# Altium project SoM.PrjPcb (part 3 of 4)

## Sheet [16] SPI_TYPEC_PWR.SchDoc: SPI, POWER and type C connector
size B; DocumentNumber: I; Revision: 01; SheetNumber: 16; SheetTotal: 19
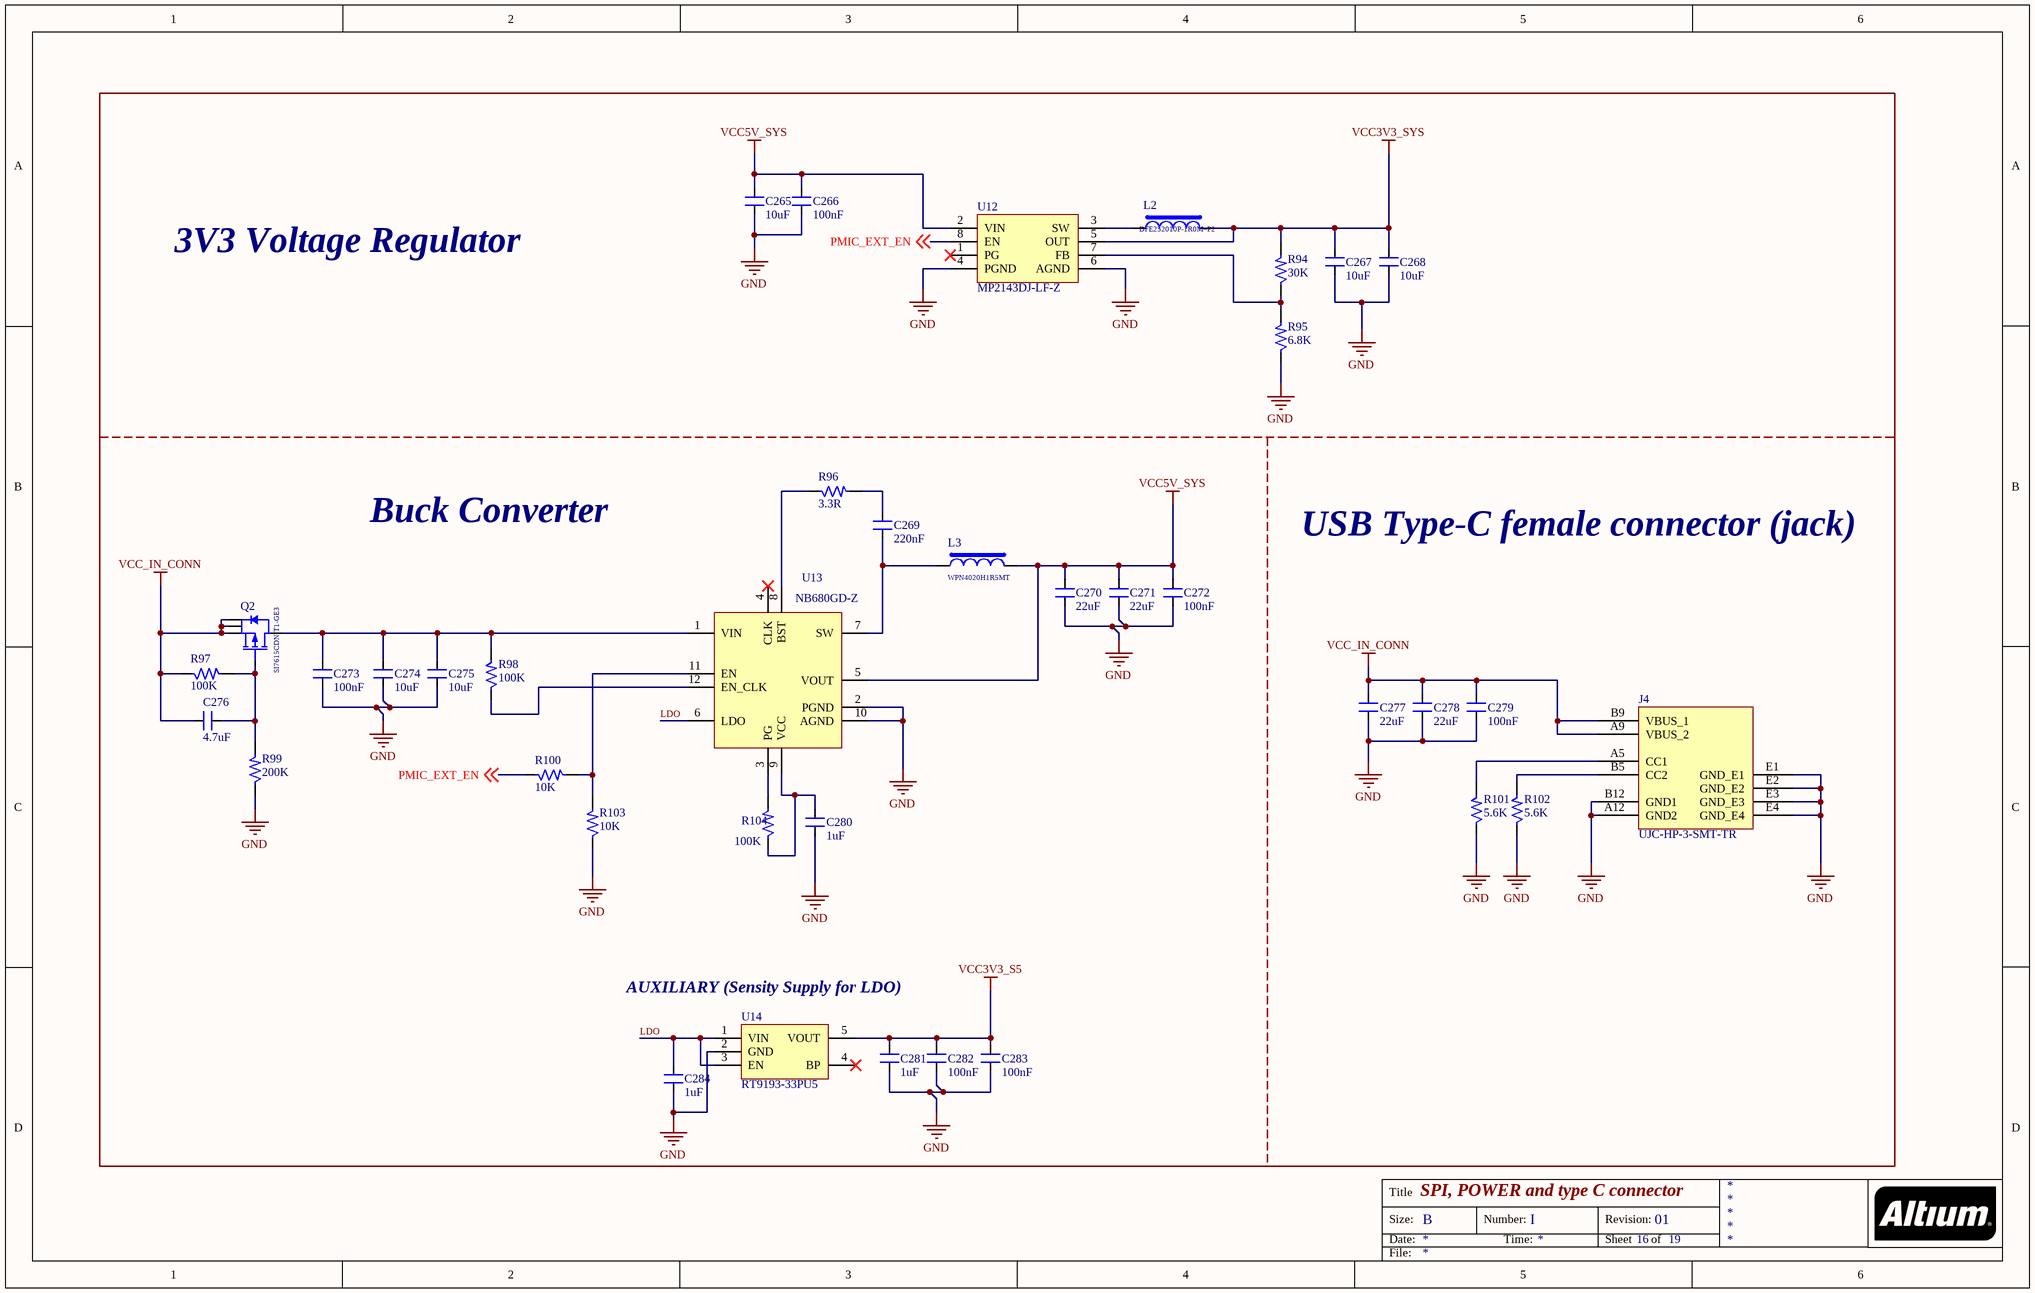
[diagram p15: [16] SPI_TYPEC_PWR.SchDoc]

### Parts
C265  10uF  [CAP_0402]
C266  100nF  [CAP_0402]
C267  10uF  [CAP_0402]
C268  10uF  [CAP_0402]
C269  220nF  [CAP_0402]
C270  22uF  [CAP_0402]
C271  22uF  [CAP_0402]
C272  100nF  [CAP_0402]
C273  100nF  [CAP_0402]
C274  10uF  [CAP_0402]
C275  10uF  [CAP_0402]
C276  4.7uF  [CAP_0402]
C277  22uF  [CAP_0402]
C278  22uF  [CAP_0402]
C279  100nF  [CAP_0201]
C280  1uF  [CAP_0402]
C281  1uF  [CAP_0402]
C282  100nF  [CAP_0402]
C283  100nF  [CAP_0402]
C284  1uF  [CAP_0402]
J4  UJC-HP-3-SMT-TR  [CON6_48.4_UJC-HP-3-SMT-TR]
L2  DFE252010P-1R0M=P2  [IND_1008]
L3  WPN4020H1R5MT  [IND_1616]
Q2  SI7615CDN-T1-GE3  [PowerPAK_1212-8_SMD]
R94  30K  [RES_0402]
R95  6.8K  [RES_0402]
R96  3.3R  [RES_0402]
R97  100K  [RES_0402]
R98  100K  [RES_0402]
R99  200K  [RES_0402]
R100  10K  [RES_0402]
R101  5.6K  [RES_0201]
R102  5.6K  [RES_0201]
R103  10K  [RES_0402]
R104  100K  [RES_0402]
U12  MP2143DJ-LF-Z  [SOT23-8]
U13  NB680GD-Z  [QFN-12_19_118X118_SMD]
U14  RT9193-33PU5  [SC70-5]

### Nets
GND: C265.1 C266.1 C267.1 C268.1 C270.1 C271.1 C272.1 C273.1 C274.1 C275.1 C277.1 C278.1 C279.1 C280.1 C281.1 C282.1 C283.1 C284.1 J4.A12(GND2) J4.B12(GND1) J4.E1(GND_E1) J4.E2(GND_E2) J4.E3(GND_E3) J4.E4(GND_E4) R95.1 R99.1 R101.1 R102.1 R103.1 U12.4(PGND) U12.6(AGND) U13.2(PGND) U13.10(AGND) U14.2(GND)
VCC3V3_S5: C281.2 C282.2 C283.2 U14.5(VOUT)
VCC3V3_SYS: C267.2 C268.2 L2.2 R94.2 U12.5(OUT)  [project net VCC7]
VCC5V_SYS: C265.2 C266.2 C270.2 C271.2 C272.2 L3.2 U12.2(VIN) U13.5(VOUT)
VCC_IN_CONN: C276.1 C277.2 C278.2 C279.2 J4.A9(VBUS_2) J4.B9(VBUS_1) Q2.1(S) Q2.2(S) Q2.3(S) R97.1
LDO: C284.2 U13.6(LDO) U14.1(VIN) U14.3(EN)
PMIC_EXT_EN: R100.1 U12.8(EN) ; off-sheet PMIC_EXT_EN
NetC269_1: C269.1 L3.1 U13.7(SW)
NetC269_2: C269.2 R96.2
NetC273_2: C273.2 C274.2 C275.2 Q2.5(D) R98.2 U13.1(VIN)
NetC276_2: C276.2 Q2.4(G) R97.2 R99.2
NetC280_2: C280.2 R104.1 U13.9(VCC)
NetJ4_A5: J4.A5(CC1) R101.2
NetJ4_B5: J4.B5(CC2) R102.2
NetL2_1: L2.1 U12.3(SW)
NetR94_1: R94.1 R95.2 U12.7(FB)
NetR96_1: R96.1 U13.8(BST)
NetR98_1: R98.1 U13.12(EN_CLK)
NetR100_2: R100.2 R103.2 U13.11(EN)
NetR104_2: R104.2 U13.3(PG)

Not connected (* = marked no-connect by the designer): U12 1(PG)*; U13 4(CLK)*; U14 4(BP)*

### Notes on the sheet
- 3V3 Voltage Regulator
- Buck Converter
- USB Type-C female connector (jack)
- AUXILIARY (Sensity Supply for LDO)
- Title
- Size:
- Date:
- B
- Number:
- Time:
- Revision:
- Sheet
- of
- File:

### Library data of the parts
C265 C267 C268 C274 C275 = CAP_10uF-10V-20%-0402: as C243 on sheet [13] TYPEC0_PROG; Case/Package: 0402; Supplier-1: Digikey
C266 = CAP_100nF-10V-10%-0402: 0.1µF ±10% 10V Ceramic Capacitor X7R 0402 (1005 Metric) /; Manufacturer: Yageo; Manufacturer Part Number: CC0402KRX7R6BB104; Case/Package: 0402; Supplier-1: Digikey
C269 = CAP_220nF-10V-10%-0402: 0.22µF ±10% 10V Ceramic Capacitor X7R 0402 (1005 Metric) /; Manufacturer: Samsung Electro-Mechanics; Manufacturer Part Number: CL05B224KP5NNNC; Case/Package: 0402; Supplier-1: Digikey
C270 C271 C277 C278 = CAP_22uF-6.3V-20%-0402: 22µF ±20% 6.3V Ceramic Capacitor X5R 0402 (1005 Metric) /; Manufacturer: Murata Electronics; Manufacturer Part Number: CL05A226MQ5N6J8; Case/Package: 0402; Supplier-1: Digikey
C272 C273 C282 C283 = CAP_100nF-25V-10%-0402: as C231 on sheet [13] TYPEC0_PROG; Case/Package: 0402; Supplier-1: Digikey
C276 = CAP_4.7uF-10V-10%-0402: 4.7µF ±10% 10V Ceramic Capacitor X5R 0402 (1005 Metric) /; Manufacturer: Samsung Electro-Mechanics; Manufacturer Part Number: CL05A475KP5NRNC; Case/Package: 0402; Supplier-1: Digikey
C279 = CAP_100nF-25V-10%-0201: as C187-C190 on sheet [4] RK3399_EMMC_ADC_PCIE; Case/Package: 0201; Supplier-1: Digikey
C280 = CAP_1uF-16V-10%-0402: as C252 on sheet [14] Ethernet; Case/Package: 0402; Supplier-1: Digikey
C281 C284 = CAP_1uF-10V-10%-0402: as C232-C234 on sheet [13] TYPEC0_PROG; Case/Package: 0402; Supplier-1: Digikey
J4 = CON-TYPEC_6X1-100-RA-TH: USB Connectors USB jack, C type, power only, 6 pin, horizonal, gold flash plating, surface mount, T&R; Manufacturer: CUI Devices; Manufacturer Part Number: UJC-HP-3-SMT-TR; Case/Package: TH; Supplier-1: Mouser
L2 = IND_1uH-3.8A-20%-1008: 1µH Shielded Wirewound Inductor 3.8A 54mOhm Max 1008 (2520 Metric) /; Manufacturer: Murata Electronics; Manufacturer Part Number: DFE252010P-1R0M=P2; Case/Package: 1008; Supplier-1: Digikey
L3 = IND_1.5uH-6A-20%-SMD: Wire Wound SMD Power Inductors – WPN Series / Operating Temp. : -40℃~+125℃ (Including self-heating) /; Manufacturer: Sunlord; Mnaufcaturer Part Number: WPN4020H1R5MT; Case/Package: SMD; Supplier-1: NA
Q2 = MOSFET-P_20V-35A-1212-8: P-Channel 20V 35A (Tc) 33W (Tc) Surface Mount PowerPAK® 1212-8 /; Manufacturer: Vishay Siliconix; Manufacturer Part Number: SI7615CDN-T1-GE3; Case/Package: PowerPAK® 1212-8; Supplier-1: Digikey
R94 = RES_30K-0.1W-1%-0402: 30 kOhms ±1% 0.1W, 1/10W Chip Resistor 0402 (1005 Metric) Automotive AEC-Q200, Moisture Resistant Thick Film /; Manufacturer: KOA Speer Electronics, Inc.; Manufacturer Part Number: RK73H1ETTP3002F; Case/Package: 0402; Supplier-1: Digikey
R95 = RES_6.8K-0.1W-1%-0402: 6.8 kOhms ±1% 0.1W, 1/10W Chip Resistor 0402 (1005 Metric) Anti-Sulfur Thin Film /; Manufacturer: Vishay Beyschlag/Draloric/BC Components; Manufacturer Part Number: MCS04020C6801FE000; Supplier-1: Digikey; Case/Package: 0402
R96 = RES_3.3R-0.1W-1%-0402: 3.3 Ohms ±1% 0.1W, 1/10W Chip Resistor 0402 (1005 Metric) Anti-Sulfur, Automotive AEC-Q200 Thick Film /; Manufacturer: Panasonic Electronic Components; Manufacturer Part Number: ERJ-U02F3R30X; Case/Package: 0402; Supplier-1: Digikey
R97 R98 R104 = RES_100K-0.1W-1%-0402: 100 kOhms ±1% 0.1W, 1/10W Chip Resistor 0402 (1005 Metric) Anti-Sulfur Thin Film /; Manufacturer: Vishay Beyschlag/Draloric/BC Components; Manufacturer Part Number: MCS04020C1003FE000; Case/Package: 0402; Supplier-1: Digikey
R99 = RES_200K-0.1W-1%-0402: 200 kOhms ±1% 0.1W, 1/10W Chip Resistor 0402 (1005 Metric) Automotive AEC-Q200 Thick Film /; Manufacturer: Panasonic Electronic Components; Manufacturer Part number: ERJ-2RKF2003X; Case/Package: 0402; Supplier-1: Digikey
R100 R103 = RES_10K-0.1W-1%-0402: 10 kOhms ±1% 0.1W, 1/10W Chip Resistor 0402 (1005 Metric) Anti-Sulfur Thin Film /; Manufacturer: Vishay Beyschlag/Draloric/BC Components; Manufacturer Part Number: MCS04020C1002FE000; Case/Package: 0402; Supplier-1: Digikey
R101 R102 = RES_5.6K-0.05W-1%-0201: 5.6 kOhms ±1% 0.05W, 1/20W Chip Resistor 0201 (0603 Metric) Automotive AEC-Q200 Thick Film /; Manufacturer: Panasonic Electronic Components; Manufacturer Part Number: ERJ-1GNF5601C; Case/Package: 0201; Supplier-1: Digikey
U12 = REG_0.6~5V-5.5V-3A-TSOT-23-8: Switching Voltage Regulators 3A, 5.5V, 1.2MHz Sync Stp-Dwn Swtchr; Manufacturer: Monolithic Power Systems (MPS); Manufacturer Part Number: MP2143DJ-LF-Z; Case/Package: TSOT-23-8; Supplier-1: Mouser
U13 = REG_3.3V-26V-8A-QFN-12: Switching Voltage Regulators 26V Fixed 3.3 V-8A Sync Buck Converter; Manufacturer: Monolithic Power Systems (MPS); Manufacturer Part Number: NB680GD-Z; Case/Package: QFN-12; Supplier-1: Mouser
U14 = REG_3.3V-5.5V-300mA-SC-70-5: SC-70-5 Dropout Regulators(LDO) RoHS; Manufacturer: Richtek Tech; Manufacturer Part Number: RT9193-33PU5; Case/Package: SC-70-5; Supplier-1: LCSC

## Sheet [17] Voltage_Regulators.SchDoc: Voltage Regulators
size B; DocumentNumber: I; Revision: 01; SheetNumber: 17; SheetTotal: 19
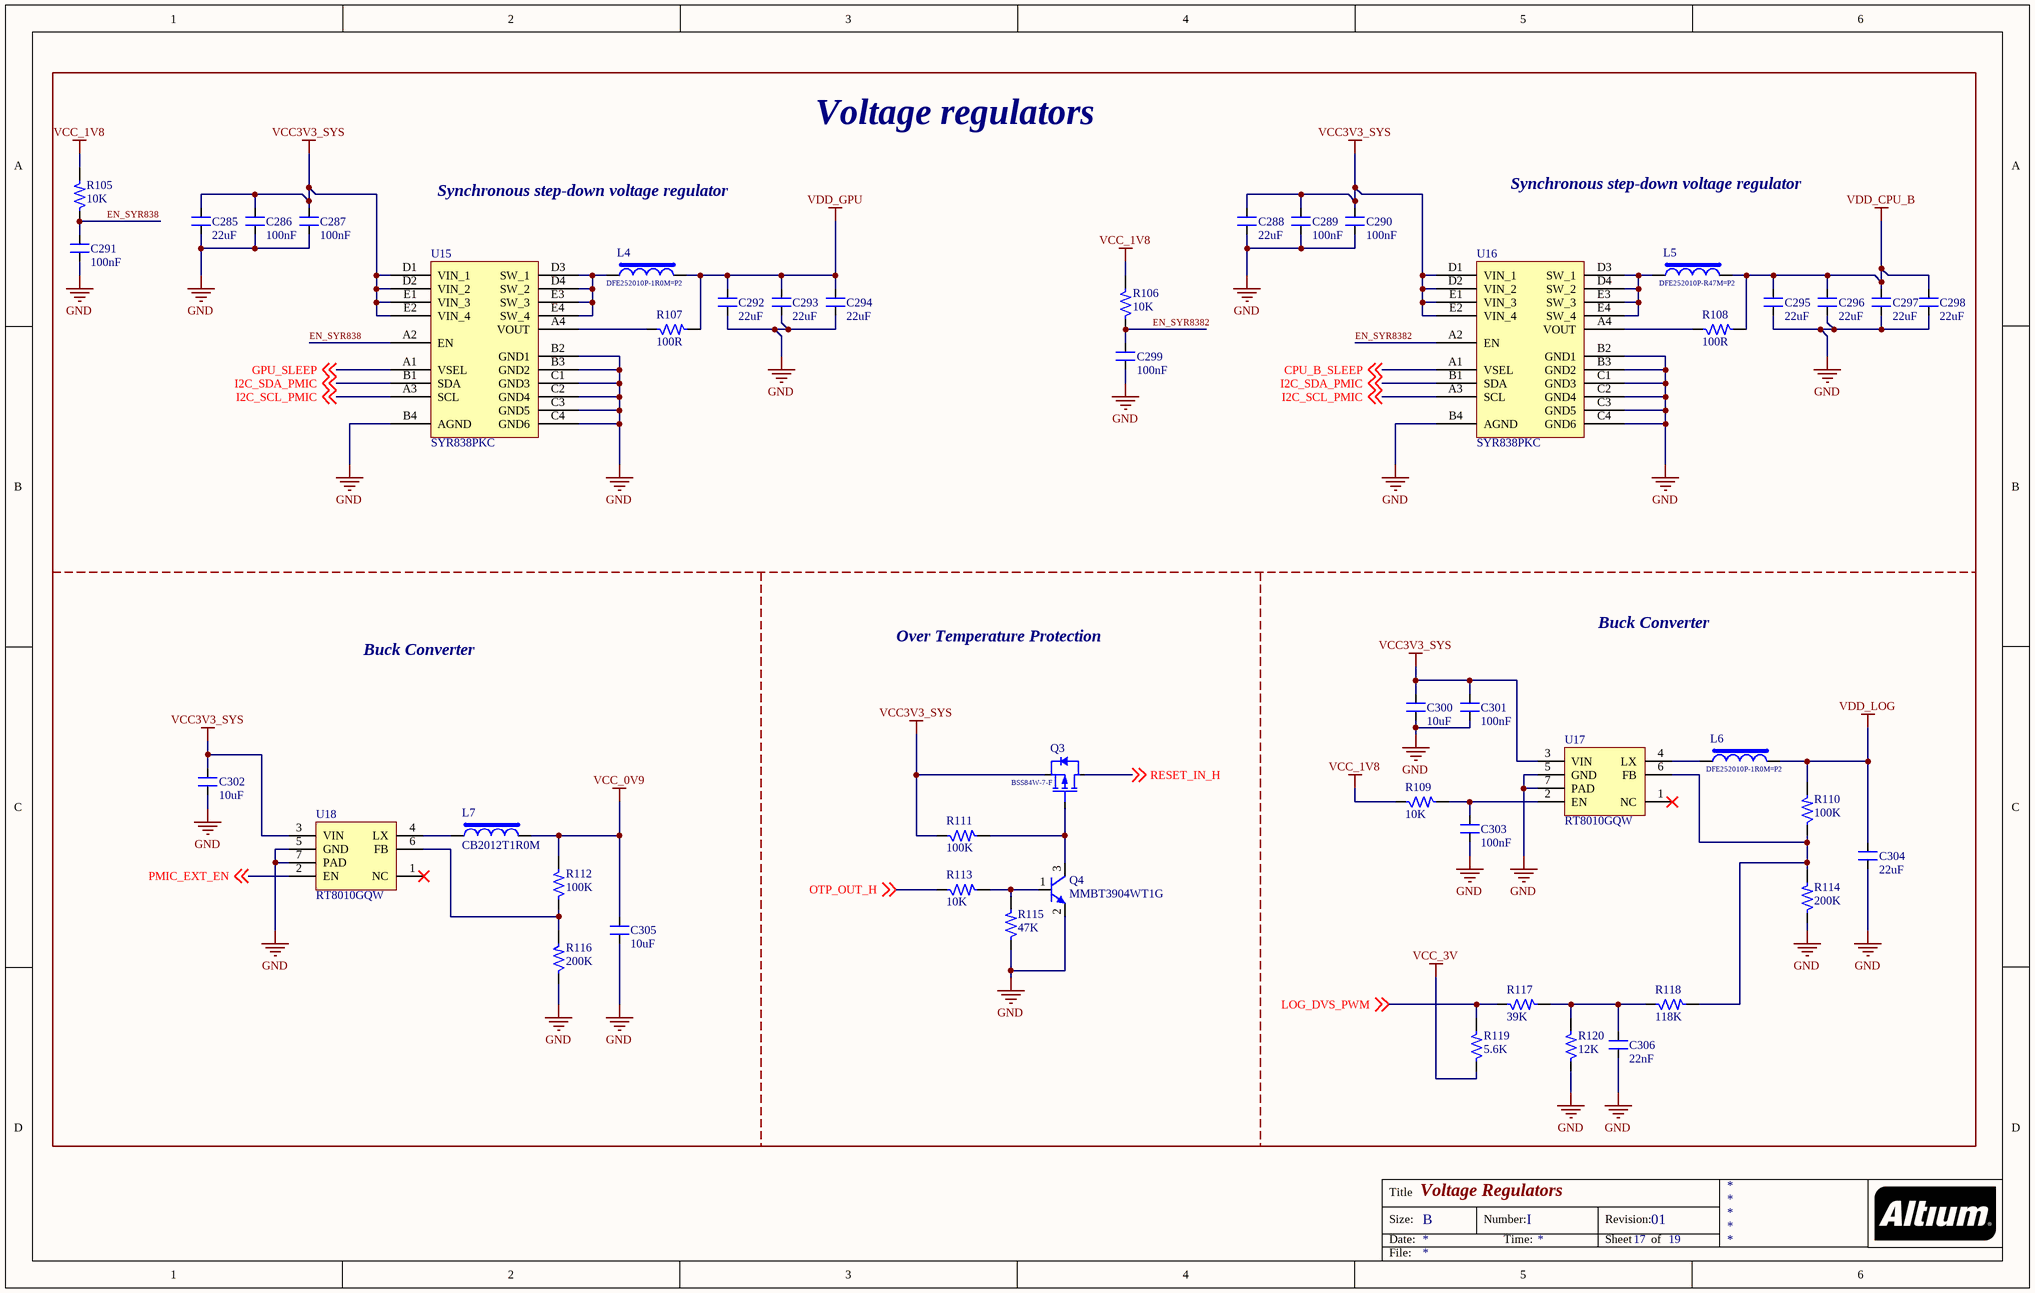
[diagram p16: [17] Voltage_Regulators.SchDoc]

### Parts
C285  22uF  [CAP_0402]
C286  100nF  [CAP_0402]
C287  100nF  [CAP_0402]
C288  22uF  [CAP_0402]
C289  100nF  [CAP_0402]
C290  100nF  [CAP_0402]
C291  100nF  [CAP_0402]
C292  22uF  [CAP_0402]
C293  22uF  [CAP_0402]
C294  22uF  [CAP_0402]
C295  22uF  [CAP_0402]
C296  22uF  [CAP_0402]
C297  22uF  [CAP_0402]
C298  22uF  [CAP_0402]
C299  100nF  [CAP_0402]
C300  10uF  [CAP_0402]
C301  100nF  [CAP_0402]
C302  10uF  [CAP_0402]
C303  100nF  [CAP_0402]
C304  22uF  [CAP_0402]
C305  10uF  [CAP_0402]
C306  22nF  [CAP_0402]
L4  DFE252010P-1R0M=P2  [IND_1008]
L5  DFE252010P-R47M=P2  [IND_1008]
L6  DFE252010P-1R0M=P2  [IND_1008]
L7  CB2012T1R0M  [IND_0805]
Q3  BSS84W-7-F  [SOT-323-3]
Q4  MMBT3904WT1G  [SOT-323-3]
R105  10K  [RES_0402]
R106  10K  [RES_0402]
R107  100R  [RES_0402]
R108  100R  [RES_0402]
R109  10K  [RES_0402]
R110  100K  [RES_0402]
R111  100K  [RES_0402]
R112  100K  [RES_0402]
R113  10K  [RES_0402]
R114  200K  [RES_0402]
R115  47K  [RES_0402]
R116  200K  [RES_0402]
R117  39K  [RES_0402]
R118  118K  [RES_0402]
R119  5.6K  [RES_0402]
R120  12K  [RES_0402]
U15  SYR838PKC  [CSP20_15.7_100x84_SMD]
U16  SYR838PKC  [CSP20_15.7_100x84_SMD]
U17  RT8010GQW  [WDFN-6_26_133X100_SMD]
U18  RT8010GQW  [WDFN-6_26_133X100_SMD]

### Nets
GND: C285.1 C286.1 C287.1 C288.1 C289.1 C290.1 C291.1 C292.1 C293.1 C294.1 C295.1 C296.1 C297.1 C298.1 C299.1 C300.1 C301.1 C302.1 C303.1 C304.1 C305.1 C306.1 Q4.2(E) R114.1 R115.1 R116.1 R120.1 U15.B2(GND1) U15.B3(GND2) U15.B4(AGND) U15.C1(GND3) U15.C2(GND4) U15.C3(GND5) U15.C4(GND6) U16.B2(GND1) U16.B3(GND2) U16.B4(AGND) U16.C1(GND3) U16.C2(GND4) U16.C3(GND5) U16.C4(GND6) U17.5(GND) U17.7(PAD) U18.5(GND) U18.7(PAD)
VCC3V3_SYS: C285.2 C286.2 C287.2 C288.2 C289.2 C290.2 C300.2 C301.2 C302.2 Q3.2(S) R111.1 U15.D1(VIN_1) U15.D2(VIN_2) U15.E1(VIN_3) U15.E2(VIN_4) U16.D1(VIN_1) U16.D2(VIN_2) U16.E1(VIN_3) U16.E2(VIN_4) U17.3(VIN) U18.3(VIN)  [project net VCC7]
VCC_0V9: C305.2 L7.2 R112.2  [project net EDP_AVDD_0V9]
VCC_1V8: R105.2 R106.2 R109.1  [project net EDP_AVDD_1V8]
VCC_3V: R119.1  [project net VLDO8]
VDD_CPU_B: C295.2 C296.2 C297.2 C298.2 L5.2 R108.2
VDD_GPU: C292.2 C293.2 C294.2 L4.2 R107.2
VDD_LOG: C304.2 L6.2 R110.2
CPU_B_SLEEP: U16.A1(VSEL) ; off-sheet CPU_B_SLEEP
EN_SYR838: C291.2 R105.1 U15.A2(EN)
EN_SYR8382: C299.2 R106.1 U16.A2(EN)
GPU_SLEEP: U15.A1(VSEL) ; off-sheet GPU_SLEEP
I2C_SCL_PMIC: U15.A3(SCL) U16.A3(SCL) ; off-sheet I2C_SCL_PMIC
I2C_SDA_PMIC: U15.B1(SDA) U16.B1(SDA) ; off-sheet I2C_SDA_PMIC
LOG_DVS_PWM: R117.1 R119.2 ; off-sheet LOG_DVS_PWM
OTP_OUT_H: R113.1 ; off-sheet OTP_OUT_H
PMIC_EXT_EN: U18.2(EN) ; off-sheet PMIC_EXT_EN
RESET_IN_H: Q3.3(D) ; off-sheet RESET_IN_H
NetC303_2: C303.2 R109.2 U17.2(EN)
NetC306_2: C306.2 R117.2 R118.1 R120.2
NetL4_1: L4.1 U15.D3(SW_1) U15.D4(SW_2) U15.E3(SW_3) U15.E4(SW_4)
NetL5_1: L5.1 U16.D3(SW_1) U16.D4(SW_2) U16.E3(SW_3) U16.E4(SW_4)
NetL6_1: L6.1 U17.4(LX)
NetL7_1: L7.1 U18.4(LX)
NetQ3_1: Q3.1(G) Q4.3(C) R111.2
NetQ4_1: Q4.1(B) R113.2 R115.2
NetR107_1: R107.1 U15.A4(VOUT)
NetR108_1: R108.1 U16.A4(VOUT)
NetR110_1: R110.1 R114.2 R118.2 U17.6(FB)
NetR112_1: R112.1 R116.2 U18.6(FB)

Not connected (* = marked no-connect by the designer): U17 1(NC)*; U18 1(NC)*

### Notes on the sheet
- Voltage regulators
- Synchronous step-down voltage regulator
- Over Temperature Protection
- Buck Converter
- Title
- Size:
- Date:
- B
- Number:
- Time:
- Revision:
- Sheet
- of
- File:

### Library data of the parts
C285 C288 C292-C298 C304 = CAP_22uF-6.3V-20%-0402: as C270 on sheet [16] SPI_TYPEC_PWR; Case/Package: 0402; Supplier-1: Digikey
C286 C287 C289-C291 C299 = CAP_100nF-25V-10%-0402: as C231 on sheet [13] TYPEC0_PROG; Case/Package: 0402; Supplier-1: Digikey
C300 C302 C305 = CAP_10uF-10V-20%-0402: as C243 on sheet [13] TYPEC0_PROG; Case/Package: 0402; Supplier-1: Digikey
C301 C303 = CAP_100nF-10V-10%-0402: as C266 on sheet [16] SPI_TYPEC_PWR; Case/Package: 0402; Supplier-1: Digikey
C306 = CAP_22nF-10V-10%-0402: 0.022µF ±10% 10V Ceramic Capacitor X7R 0402 (1005 Metric) /; Manufacturer: Samsung Electro-Mechanics; Manufacturer Part Number: CL05B223KP5NNNC; Case/Package: 0402; Supplier-1: Digikey
L4 L6 = IND_1uH-3.8A-20%-1008: as L2 on sheet [16] SPI_TYPEC_PWR; Manufacturer Part Number: DFE252010P-1R0M=P2; Case/Package: 1008; Supplier-1: Digikey
L5 = IND_470nH-5A-20%-1008: 470nH Shielded Wirewound Inductor 5A 35mOhm Max 1008 (2520 Metric); Manufacturer: Murata Electronics; Manufacturer Part Number: DFE252010P-R47M=P2; Case/Package: 1008; Supplier-1: Digikey
L7 = IND_1uF-0.5A-20%-0805: 1uH ±20% 500mA 150mΩ 0805 Inductors (SMD) RoHS /; Manufacturer: Taiyo Yuden; Manufacturer Part Number: CB2012T1R0M; Case/Package: 0805; Supplier-1: LCSC
Q3 = MOSFET-P_50V-130mA-SOT-323: P-Channel 50V 130mA (Ta) 200mW (Ta) Surface Mount SOT-323; Manufacturer: Diodes Incorporated; Manufacturer Part Number: BSS84W-7-F; Case/Package: SOT-323; Supplier-1: Digikey
Q4 = TRAN-NPN_40V-200mA-SOT323: Bipolar (BJT) Transistor NPN 40V 200mA 300MHz 150mW Surface Mount SC-70-3 (SOT323); Manufacturer: ON Semiconductor; Manufacturer Part Number: MMBT3904WT1G; Case/Package: SOT323; Supplier-1: Digikey
R105 R106 R109 R113 = RES_10K-0.1W-1%-0402: as R100 on sheet [16] SPI_TYPEC_PWR; Case/Package: 0402; Supplier-1: Digikey
R107 R108 = RES_100R-0.1W-1%-0402: 100 Ohms ±1% 0.1W, 1/10W Chip Resistor 0402 (1005 Metric) Automotive AEC-Q200, Moisture Resistant Thick Film /; Manufacturer: KOA Speer Electronics, Inc.; Manufacturer Part Number: RK73H1ETTP1000F; Case/Package: 0402; Supplier-1: Digikey
R110-R112 = RES_100K-0.1W-1%-0402: as R97 on sheet [16] SPI_TYPEC_PWR; Case/Package: 0402; Supplier-1: Digikey
R114 R116 = RES_200K-0.1W-1%-0402: as R99 on sheet [16] SPI_TYPEC_PWR; Case/Package: 0402; Supplier-1: Digikey
R115 = RES_47K-0.1W-1%-0402: 47 kOhms ±1% 0.1W, 1/10W Chip Resistor 0402 (1005 Metric) Automotive AEC-Q200 Thick Film /; Manufacturer: Panasonic Electronic Components; Manufacturer Part Number: ERJ-2RKF4702X; Case/Package: 0402; Supplier-1: Digikey
R117 = RES_39K-0.1W-1%-0402: 39 kOhms ±1% 0.1W, 1/10W Chip Resistor 0402 (1005 Metric) Automotive AEC-Q200, Moisture Resistant Thick Film /; Manufacturer: KOA Speer Electronics, Inc.; Manufacturer Part Number: RK73H1ETTP3902F; Case/Package: 0402; Supplier-1: Digikey
R118 = RES_118K-0.1W-1%-0402: 118 kOhms ±1% 0.1W, 1/10W Chip Resistor 0402 (1005 Metric) Automotive AEC-Q200, Moisture Resistant Thick Film /; Manufacturer: KOA Speer Electronics, Inc.; Manuafcturer Part Number: RK73H1ETTP1183F; Case/Package: 0402; Supplier-1: Digikey
R119 = RES_5.6K-0.1W-1%-0402: 5.6 kOhms ±1% 0.1W, 1/10W Chip Resistor 0402 (1005 Metric) Automotive AEC-Q200, Moisture Resistant Thick Film /; Manufacturer: KOA Speer Electronics, Inc.; Manufacturer Part Number: RK73H1ETTP5601F; Case/Package: 0402; Supplier-1: Digikey
R120 = RES_12K-0.1W-1%-0402: 12 kOhms ±1% 0.1W, 1/10W Chip Resistor 0402 (1005 Metric) Anti-Sulfur Thin Film /; Manufacturer: Vishay Beyschlag/Draloric/BC Components; Manufacturer Part Number: MCS04020C1202FE000; Case/Package: 0402; Supplier-1: Digikey
U15 U16 = IC_SYR838PKC: Step-Down Positive Programmable 1 6A 2.4MHz CSP1.56*1.96-20 DC-DC Converters RoHS; Manufacturer: Silergy Corp; Manufacturer Part Number: SYR838PKC; Case/Package: CSP1.56*1.96-20; Supplier-1: LCSC
U17 U18 = REG-ADJ_5.5V-5.5V-1A-6-WDFN: Buck Switching Regulator IC Positive Adjustable 0.6V 1 Output 1A 6-WDFN Exposed Pad; Manufacturer: Richtek USA Inc.; Manufacturer Part Number: RT8010GQW; Case/Package: 6-WDFN; Supplier-1: Digikey